# Altium schematic sheet 4_Darlington Pair Amplifier.SchDoc
size A4; SheetNumber: 5; SheetTotal: 6
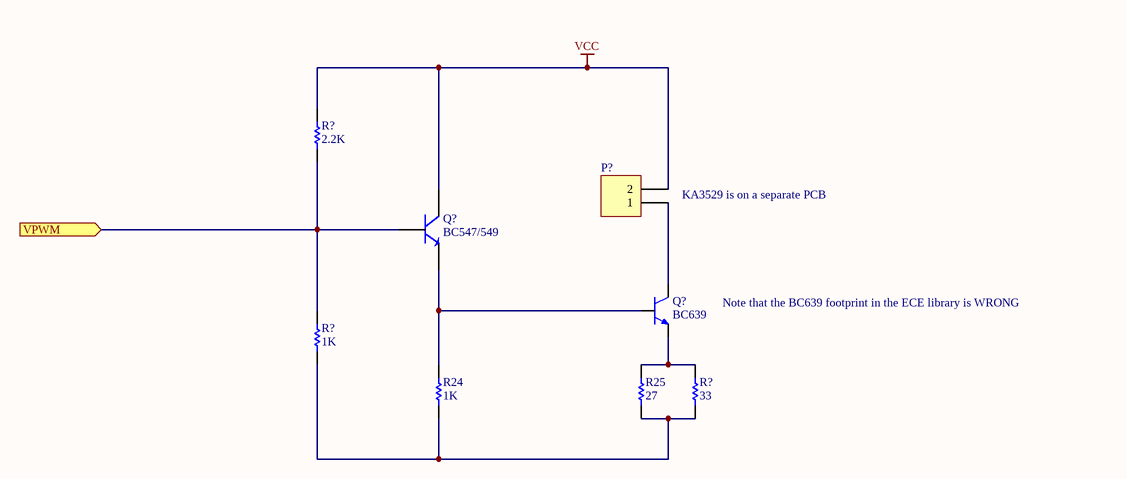
[diagram p0: 4_Darlington Pair Amplifier.SchDoc]

## Parts
(Parts that share a designator on the sheet are numbered #1, #2 ... from top to bottom, then left to right.)
P?  Header 2  [ece-HDR1X2]  (value not drawn)
Q?#1  BC547/549  [ece-TO-92Z]
Q?#2  BC639  [TO92]
R24  1K  [ece-AXIAL0.4]
R25  27  [ece-AXIAL0.4]
R?#1  2.2K  [ece-AXIAL0.4]
R?#2  1K  [ece-AXIAL0.4]
R?#3  33  [ece-AXIAL0.4]

## Ports
VPWM (in)

## Nets
VCC: P?.2 Q?#1.1(C) R?#1.2
VPWM: Q?#1.2(B) R?#1.1 R?#2.2 ; port VPWM
NetP?_1: P?.1 Q?#2.2
NetQ?#1_3: Q?#1.3(E) Q?#2.3 R24.2
NetQ?#2_1: Q?#2.1 R25.2 R?#3.2
NetR24_1: R24.1 R25.1 R?#2.1 R?#3.1

## Notes on the sheet
- (near P?) KA3529 is on a separate PCB
- Note that the BC639 footprint in the ECE library is WRONG

## Library data of the parts
P? = Header 2: Header, 2-Pin; LatestRevisionDate: 17-Jul-2002; LatestRevisionNote: Re-released for DXP Platform.; Publisher: Altium Limited
Q?#1 = BC547/549: NPN Transistor; Value: BC547/549
Q?#2 = BC639: BC639 with correct footprint
R24 R25 R?#1-R?#3 = Res1: Resistor; Published: 8-Jun-2000; LatestRevisionDate: 17-Jul-2002; LatestRevisionNote: Re-released for DXP Platform.; PackageReference: AXIAL-0.3; Publisher: Altium Limited; Value: *